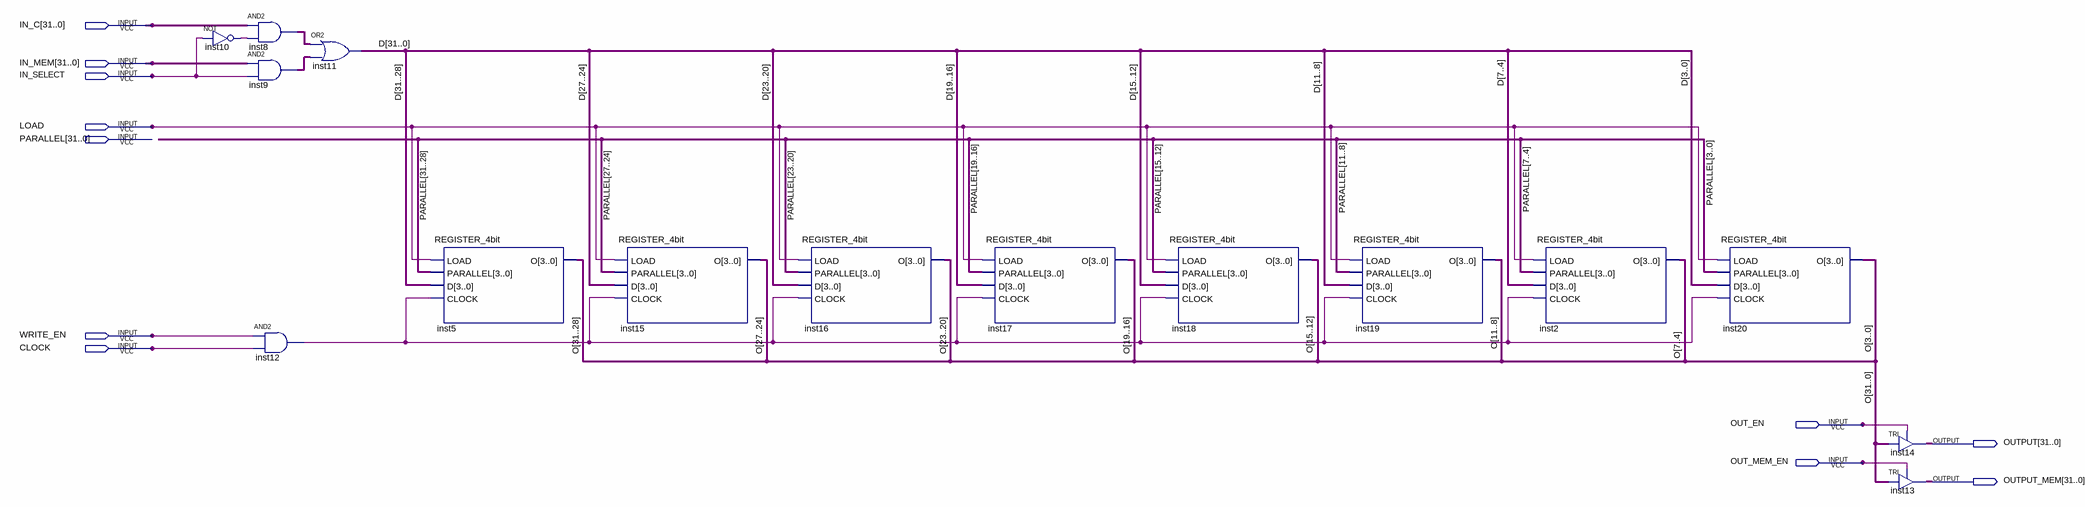
[diagram p0: schematic sheet]
// Quartus schematic REGISTER_32bit.bdf as structural Verilog: 15 symbols, 11 pins
module REGISTER_32bit (
  input  [31:0] IN_C,
  input  [31:0] IN_MEM,
  input  IN_SELECT,
  input  LOAD,
  input  [31:0] PARALLEL,
  input  WRITE_EN,
  input  CLOCK,
  input  OUT_EN,
  input  OUT_MEM_EN,
  output [31:0] OUTPUT,
  output [31:0] OUTPUT_MEM
);

  wire inst10_out, inst12_out;
  wire [31:0] D, inst8_out, inst9_out, O;

  not inst10 (inst10_out, IN_SELECT);
  assign inst8_out = IN_C & {32{inst10_out}};  // AND2 inst8, 32 bits wide
  assign inst9_out = IN_MEM & {32{IN_SELECT}};  // AND2 inst9, 32 bits wide
  and inst12 (inst12_out, WRITE_EN, CLOCK);
  assign D = inst8_out | inst9_out;  // OR2 inst11, 32 bits wide
  REGISTER_4bit inst5 (.LOAD(LOAD), .PARALLEL(PARALLEL[31:28]), .D(D[31:28]), .CLOCK(inst12_out), .O(O[31:28]));
  REGISTER_4bit inst15 (.LOAD(LOAD), .PARALLEL(PARALLEL[27:24]), .D(D[27:24]), .CLOCK(inst12_out), .O(O[27:24]));
  REGISTER_4bit inst16 (.LOAD(LOAD), .PARALLEL(PARALLEL[23:20]), .D(D[23:20]), .CLOCK(inst12_out), .O(O[23:20]));
  REGISTER_4bit inst17 (.LOAD(LOAD), .PARALLEL(PARALLEL[19:16]), .D(D[19:16]), .CLOCK(inst12_out), .O(O[19:16]));
  REGISTER_4bit inst18 (.LOAD(LOAD), .PARALLEL(PARALLEL[15:12]), .D(D[15:12]), .CLOCK(inst12_out), .O(O[15:12]));
  REGISTER_4bit inst19 (.LOAD(LOAD), .PARALLEL(PARALLEL[11:8]), .D(D[11:8]), .CLOCK(inst12_out), .O(O[11:8]));
  REGISTER_4bit inst2 (.LOAD(LOAD), .PARALLEL(PARALLEL[7:4]), .D(D[7:4]), .CLOCK(inst12_out), .O(O[7:4]));
  REGISTER_4bit inst20 (.LOAD(LOAD), .PARALLEL(PARALLEL[3:0]), .D(D[3:0]), .CLOCK(inst12_out), .O(O[3:0]));
  TRI inst14[31:0] (.IN(O), .OE(OUT_EN), .OUT(OUTPUT));
  TRI inst13[31:0] (.IN(O), .OE(OUT_MEM_EN), .OUT(OUTPUT_MEM));
endmodule
